# EAGLE design OSSIBeaconPA (EAGLE 6.1)
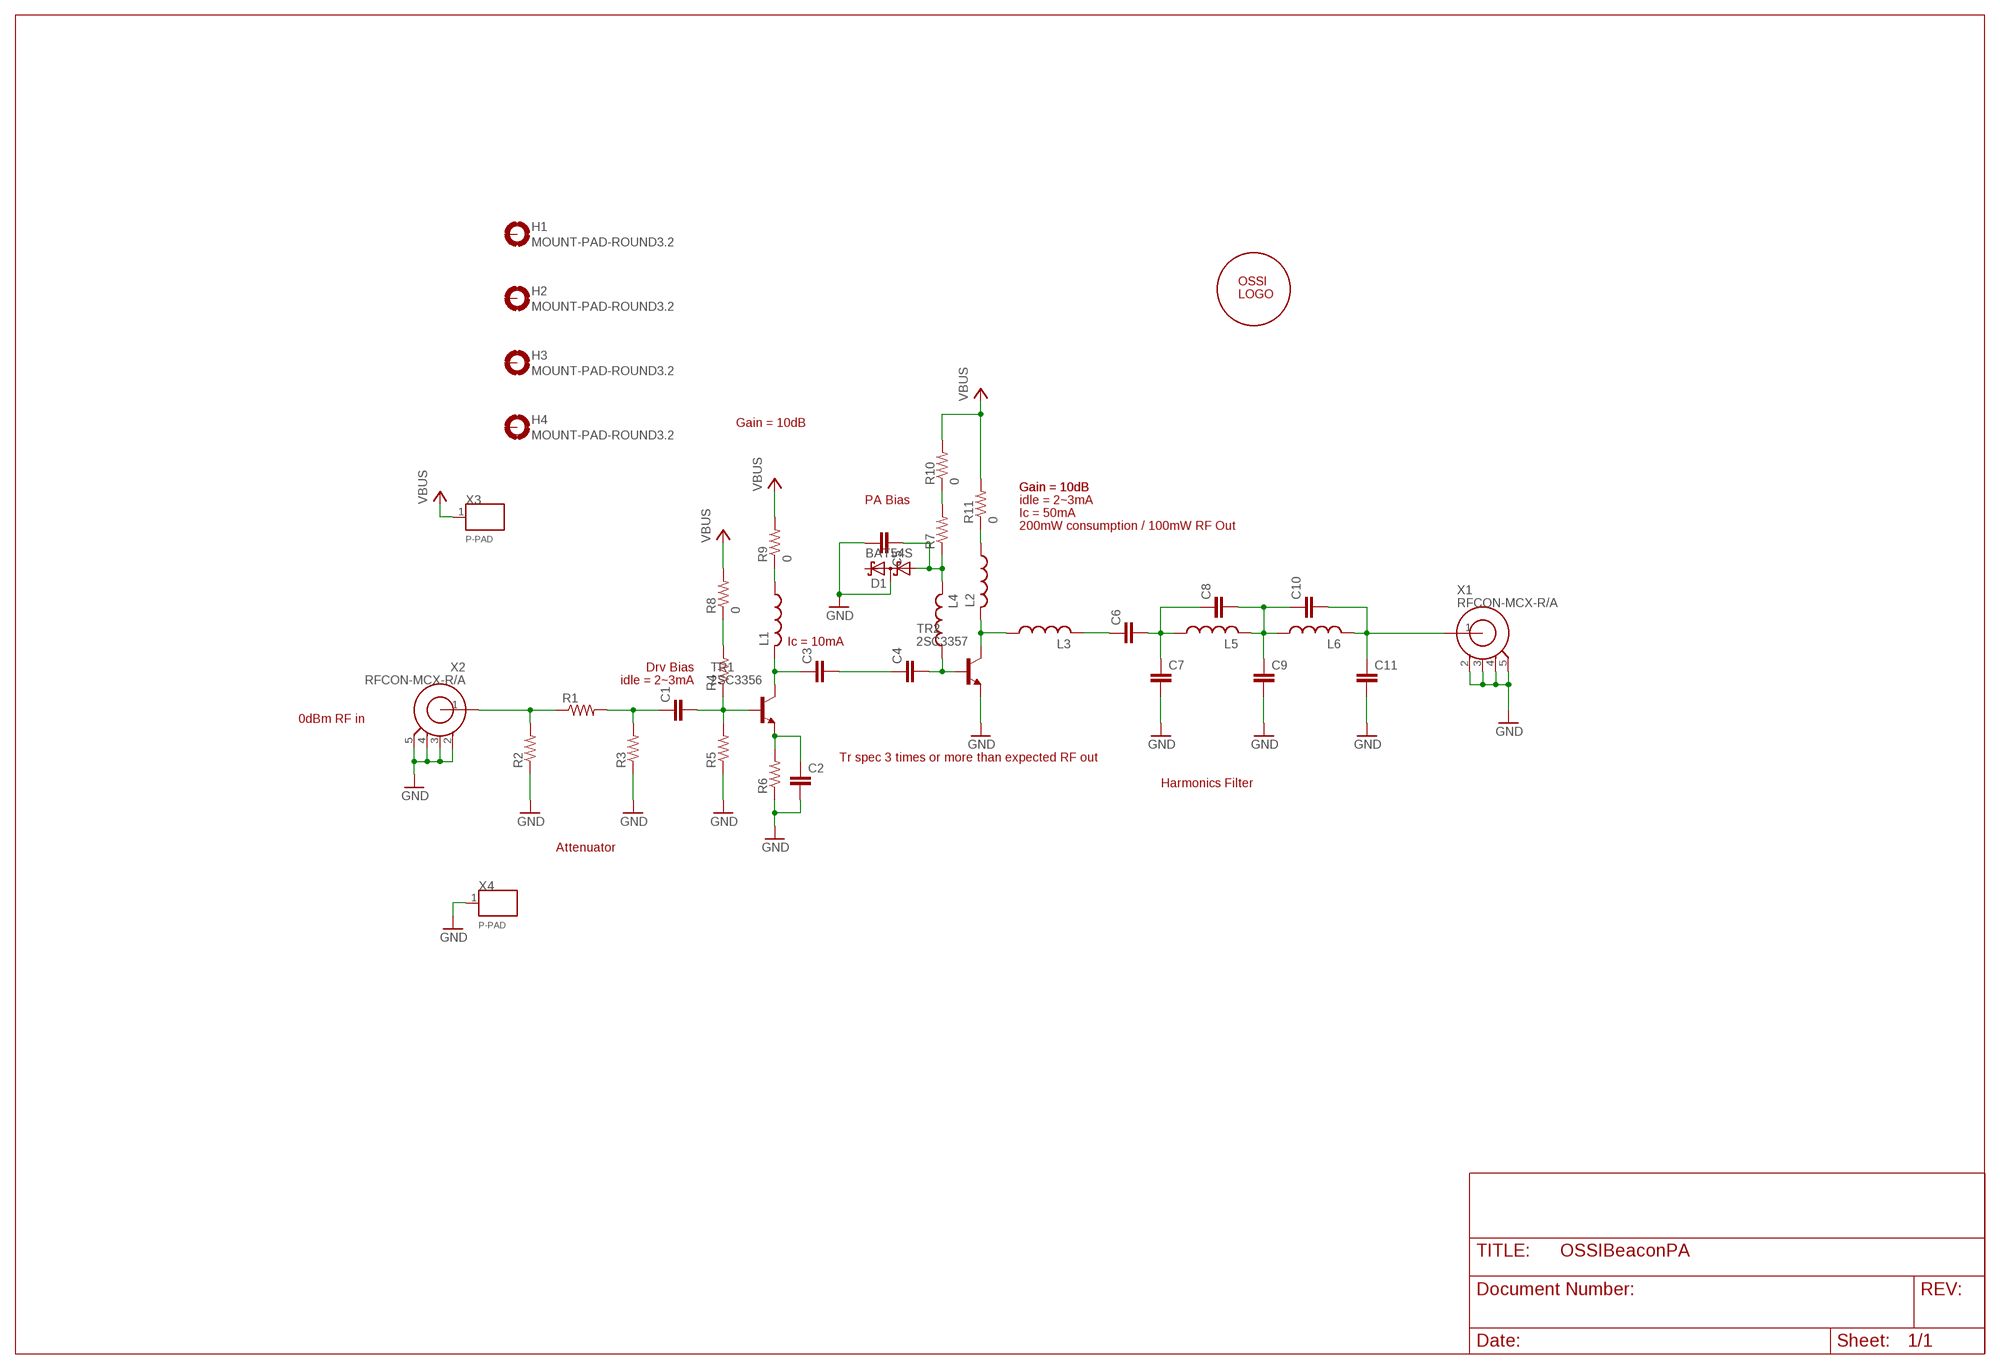
[diagram p0: schematic, sheet 1]

## Parts
C1  C0603(1608)  [C0603(1608)]
C2  C0603(1608)  [C0603(1608)]
C3  C0603(1608)  [C0603(1608)]
C4  C0603(1608)  [C0603(1608)]
C5  C0603(1608)  [C0603(1608)]
C6  C0603(1608)  [C0603(1608)]
C7  C0603(1608)  [C0603(1608)]
C8  C0603(1608)  [C0603(1608)]
C9  C0603(1608)  [C0603(1608)]
C10  C0603(1608)  [C0603(1608)]
C11  C0603(1608)  [C0603(1608)]
D1  BAT54S  [SOT23]
H1  MOUNT-PAD-ROUND3.2  [3.2-PAD-ROUND]
H2  MOUNT-PAD-ROUND3.2  [3.2-PAD-ROUND]
H3  MOUNT-PAD-ROUND3.2  [3.2-PAD-ROUND]
H4  MOUNT-PAD-ROUND3.2  [3.2-PAD-ROUND]
L1  L1008(2502)  [L1008(2520)]
L2  L1008(2502)  [L1008(2520)]
L3  L0603(1608)  [L0603(1608)]
L4  L0603(1608)  [L0603(1608)]
L5  L0603(1608)  [L0603(1608)]
L6  L0603(1608)  [L0603(1608)]
R1  R0603(1608)  [R0603(1608)]
R2  R0603(1608)  [R0603(1608)]
R3  R0603(1608)  [R0603(1608)]
R4  R0603(1608)  [R0603(1608)]
R5  R0603(1608)  [R0603(1608)]
R6  R0603(1608)  [R0603(1608)]
R7  R0603(1608)  [R0603(1608)]
R8  0  R0603(1608)  [R0603(1608)]
R9  0  R0603(1608)  [R0603(1608)]
R10  0  R0603(1608)  [R0603(1608)]
R11  0  R0603(1608)  [R0603(1608)]
TR1  2SC3356  [SOT23-BEC]
TR2  2SC3357  [SOT89-R]
U$1  OSSILOGO  [OSSILOGORECT1005]
X1  RFCON-MCX-R/A  [MCX-R/A]
X2  RFCON-MCX-R/A  [MCX-R/A]
X3  P-PAD  [P-PAD]
X4  P-PAD  [P-PAD]

## Nets
GND: C2.2 C5.2 C7.2 C9.2 C11.2 D1.3(C1A2) R2.1 R3.1 R5.1 R6.1 TR2.E X1.2 X1.3 X1.4 X1.5 X2.2 X2.3 X2.4 X2.5 X4.1
N$1: R1.1 R2.2 X2.1
N$2: C1.1 R1.2 R3.2
N$3: C1.2 R4.1 R5.2 TR1.B
N$4: C3.1 L1.P$2 TR1.C
N$5: C2.1 R6.2 TR1.E
N$6: C3.2 C4.1
N$7: C4.2 L4.1 TR2.B
N$8: C5.1 D1.1(A1) L4.2 R7.1
N$9: L2.P$2 L3.1 TR2.C
N$10: C6.1 L3.2
N$11: C6.2 C7.1 C8.1 L5.1
N$12: C8.2 C9.1 C10.1 L5.2 L6.1
N$13: C10.2 C11.1 L6.2 X1.1
N$14: R4.2 R8.1
N$15: L1.P$1 R9.1
N$16: R7.2 R10.1
N$17: L2.P$1 R11.1
VBUS: R8.2 R9.2 R10.2 R11.2 X3.1
Unconnected: D1.2(C2) H1.B3,2(MOUNT) H2.B3,2(MOUNT) H3.B3,2(MOUNT) H4.B3,2(MOUNT)

## Notes on the sheet
- Gain = 10dB
- Gain = 10dB | Gain = 10dB
- PA Bias | idle = 2~3mA
- Ic = 50mA
- 200mW consumption / 100mW RF Out
- Ic = 10mA
- Drv Bias
- idle = 2~3mA
- 0dBm RF in
- Tr spec 3 times or more than expected RF out
- Harmonics Filter
- Attenuator

## Library data of the parts
C1-C11 = OSSI:C
D1 = OSSI:BAT54S: Schottky Diodes Pin connection corrected 2011-05-04 Source: Fairchild .. BAT54.pdf
H1-H4 = OSSI:MOUNT-PAD-ROUND
L1-L6 = OSSI:L
R1-R11 = OSSI:R
TR1 = OSSI:2SC3356
TR2 = OSSI:2SC3357
U$1 = OSSI:OSSILOGO
X1 X2 = OSSI:RFCON: RF Connectors
X3 X4 = OSSI:P-PAD

## Board
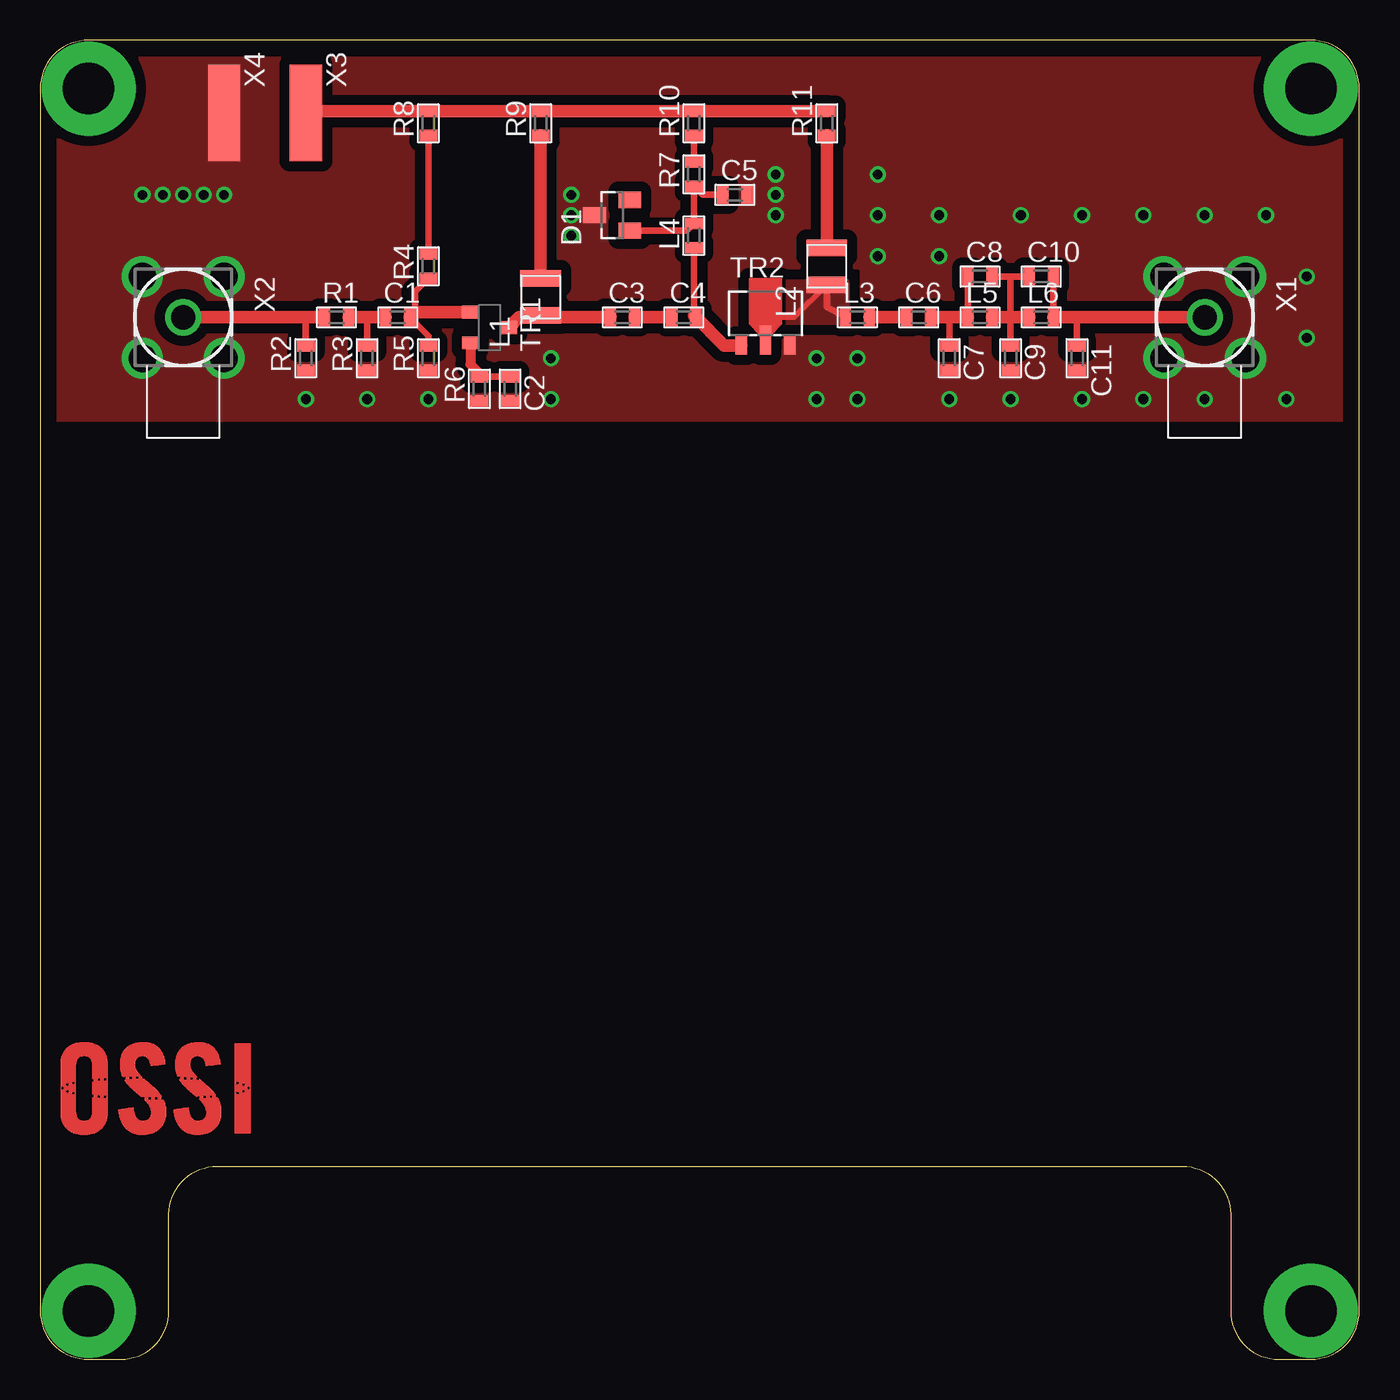
[diagram p1: board, top side]
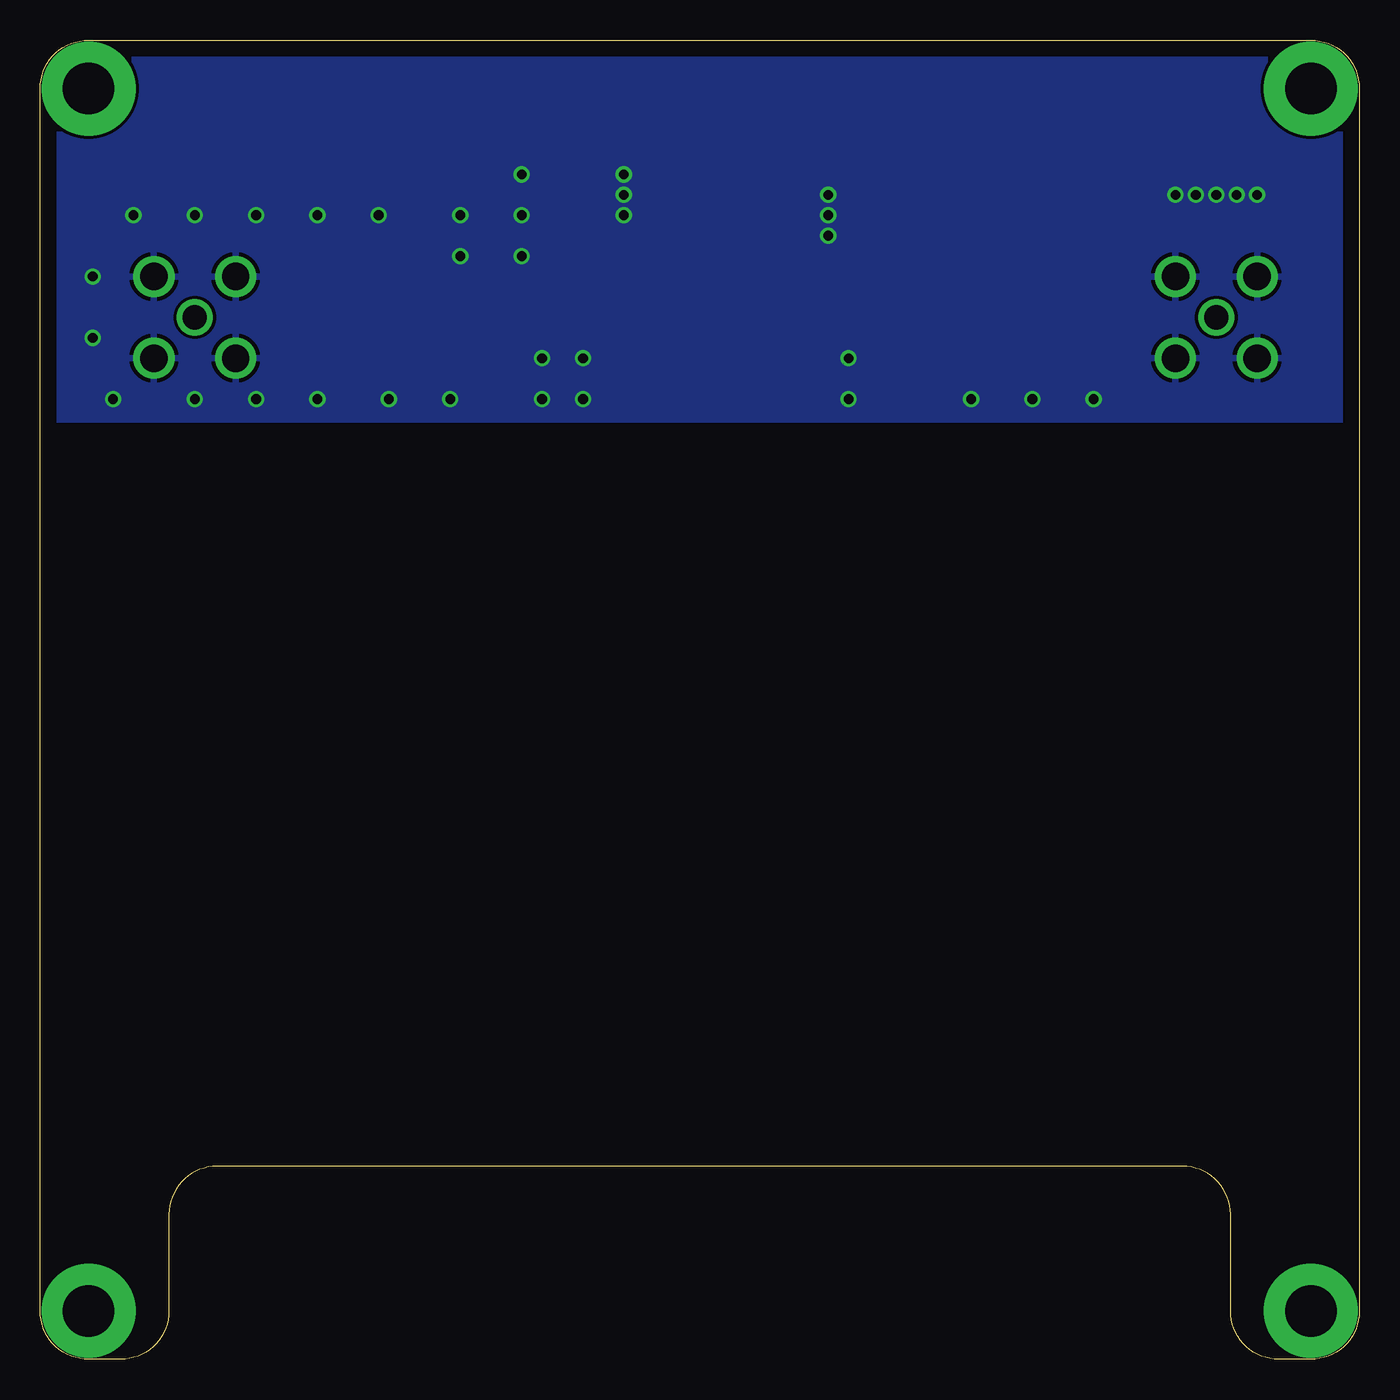
[diagram p2: board, bottom side, seen from below]

Size 82 x 82 mm. Coordinates in mm from the lower left corner, seen from the top.
Outline: 79,82 3,82 arc90 0,79 0,3 arc90 3,0 5,0 arc90 8,3 8,9 arc-90 11,12 71,12 arc-90 74,9 74,3 arc90 77,0 79,0 arc90 82,3 82,79 arc90 79,82
Copper layers (1*16): Top 0.035mm / dielectric 1.5mm / Bottom 0.035mm
Design rules: minimum track width 10mil, minimum drill 24mil, track to track 8mil, track to pad 8mil, pad to pad 8mil, via to via 8mil, smd to smd 8mil, copper to edge 40mil, drill to drill 8mil, minimum pad ring 10mil, minimum via ring 8mil, stop-mask expansion 4mil, vias tented up to drill 0mil, thermal gap 10mil

### Footprints (pad centres in the part's own frame; a part is rotated, then mirrored left to right if it is on the bottom)
C0603(1608) = smd 0.7 x 1.1: 1 -0.75,0; 2 0.75,0
SOT23 = smd 1 x 1.4: 1 -0.95,-1.1; 2 0.95,-1.1; 3 0,1.1
3.2-PAD-ROUND = drill 3.2 pad 5.842: B3,2 0,0
L1008(2520) = smd 2.54 x 1.02: P$1 0,1.145; P$2 0,-1.145
L0603(1608) = smd 0.7 x 1.1: 1 -0.75,0; 2 0.75,0
R0603(1608) = smd 0.7 x 1.1: 1 -0.75,0; 2 0.75,0
SOT23-BEC = smd 0.8 x 1: B -0.95,-1.2; C 0,1.2; E 0.95,-1.2
SOT89-R = smd 0.7 x 1.1: B -1.5,-1.75; E 1.5,-1.75 | smd 0.7 x 1.8: C 0,-1.4
MCX-R/A = drill 1.5: 1 0,0 | drill 1.7: 2 -2.54,2.54; 3 2.54,2.54; 4 2.54,-2.54; 5 -2.54,-2.54
P-PAD = smd 6 x 2: 1 0,0

### Placement (x,y rotation side)
C1  22.23,64.77 0 top
C2  29.21,60.33 270 top
C3  36.2,64.77 0 top
C4  40.01,64.77 0 top
C5  43.18,72.39 0 top
C6  54.61,64.77 0 top
C7  56.52,62.23 270 top
C8  58.42,67.31 0 top
C9  60.33,62.23 270 top
C10  62.23,67.31 0 top
C11  64.45,62.23 270 top
D1  35.56,71.12 90 top
H1  3,3 0 top
H2  3,79 0 top
H3  79,79 0 top
H4  79,3 0 top
L1  31.11,66.04 0 top
L2  48.9,67.94 0 top
L3  50.8,64.77 0 top
L4  40.64,69.85 90 top
L5  58.42,64.77 0 top
L6  62.23,64.77 0 top
R1  18.41,64.77 0 top
R2  16.51,62.23 90 top
R3  20.32,62.23 90 top
R4  24.13,67.94 90 top
R5  24.13,62.23 90 top
R6  27.3,60.33 90 top
R7  40.64,73.66 90 top
R8  24.13,76.83 90 top
R9  31.11,76.83 90 top
R10  40.64,76.83 90 top
R11  48.9,76.83 90 top
TR1  27.94,64.14 270 top
TR2  45.09,64.77 0 top
U$1  1.27,13.97 0 top
X1  72.39,64.77 270 top
X2  8.89,64.77 270 top
X3  16.51,77.47 270 top
X4  11.43,77.47 270 top

### Tracks (layer width: path | path; a pad name or v marks a point on that pad's centre or on a via)
GND  (via drill 0.6)
  other vias: 33.02,71.12 33.02,72.39 33.02,69.85 45.72,72.39 45.72,73.66 45.72,71.12 6.35,72.39 7.62,72.39 8.89,72.39 10.16,72.39 11.43,72.39 56.52,59.69 60.33,59.69 64.77,59.69 16.51,59.69 20.32,59.69 24.13,59.69 52.07,73.66 52.07,71.12 52.07,68.58 55.88,68.58 55.88,71.12 60.96,71.12 64.77,71.12 68.58,71.12 48.26,59.69 50.8,59.69 50.8,62.23 48.26,62.23 72.39,71.12 76.2,71.12 78.74,67.31 78.74,63.5 77.47,59.69 72.39,59.69 68.58,59.69 31.75,59.69 31.75,62.23
  pour Top (isolate 0.635, rank 4, no thermals): 0,82.55 82.55,82.55 82.55,58.42 0,58.42
  pour Bottom: 0,82.55 82.55,82.55 82.55,58.42 0,58.42
N$1
  Top 0.406: R2.2 16.51,64.77
  Top 0.762: X2.1 16.51,64.77 R1.1
N$2
  Top 0.406: R3.2 20.32,64.77
  Top 0.762: R1.2 20.32,64.77 C1.1
N$3
  Top 0.406: R5.2 24.13,63.62 C1.2 | 23.29,65.08 23.29,66.36 R4.1
  Top 0.762: TR1.B 23.29,65.08 C1.2
N$4
  Top 0.762: 30.8,64.77 29.77,64.77 TR1.C | L1.P$2 30.67,64.89 30.8,64.77 | C3.1 30.8,64.77
N$5
  Top 0.406: 27.3,61.28 R6.2 | R6.2 27.3,60.96 | C2.1 R6.2
  Top 0.61: TR1.E 26.74,61.84 27.3,61.28
N$6
  Top 0.762: C3.2 C4.1
N$7
  Top 0.406: L4.1 40.64,64.89
  Top 0.762: TR2.B 42.51,63.02 C4.2 40.64,64.89
N$8
  Top 0.406: D1.1 40.21,70.17 L4.2 R7.1 41.16,72.39 C5.1
N$9
  Top 0.305: TR2.C 45.09,64.14 45.72,64.77 46.87,64.77 L2.P$2
  Top 0.406: L3.1 48.9,65.41 L2.P$2 48.9,66.99
  pour Top (no thermals): 50.16,64.45 45.09,64.45 45.09,66.99 50.16,66.99
N$10
  Top 0.762: L3.2 C6.1
N$11
  Top 0.406: C7.1 56.52,64.77 | C8.1 L5.1
  Top 0.762: L5.1 56.52,64.77 C6.2
N$12
  Top 0.406: C9.1 60.33,64.77 60.33,67.31 | C10.1 60.33,67.31 | 60.33,67.31 C8.2
  Top 0.762: L5.2 60.33,64.77 L6.1
N$13
  Top 0.406: C10.2 L6.2 | C11.1 64.45,64.77
  Top 0.762: X1.1 64.45,64.77 L6.2
N$14
  Top 0.406: R4.2 R8.1 24.13,76.2
N$15
  Top 0.762: R9.1 L1.P$1
N$16
  Top 0.406: R7.2 R10.1
N$17
  Top 0.762: L2.P$1 R11.1
VBUS
  Top 0.762: R11.2 R10.2 R9.2 R8.2 16.62,77.58 X3.1